# Altium schematic sheet Sheet2.SchDoc
size B
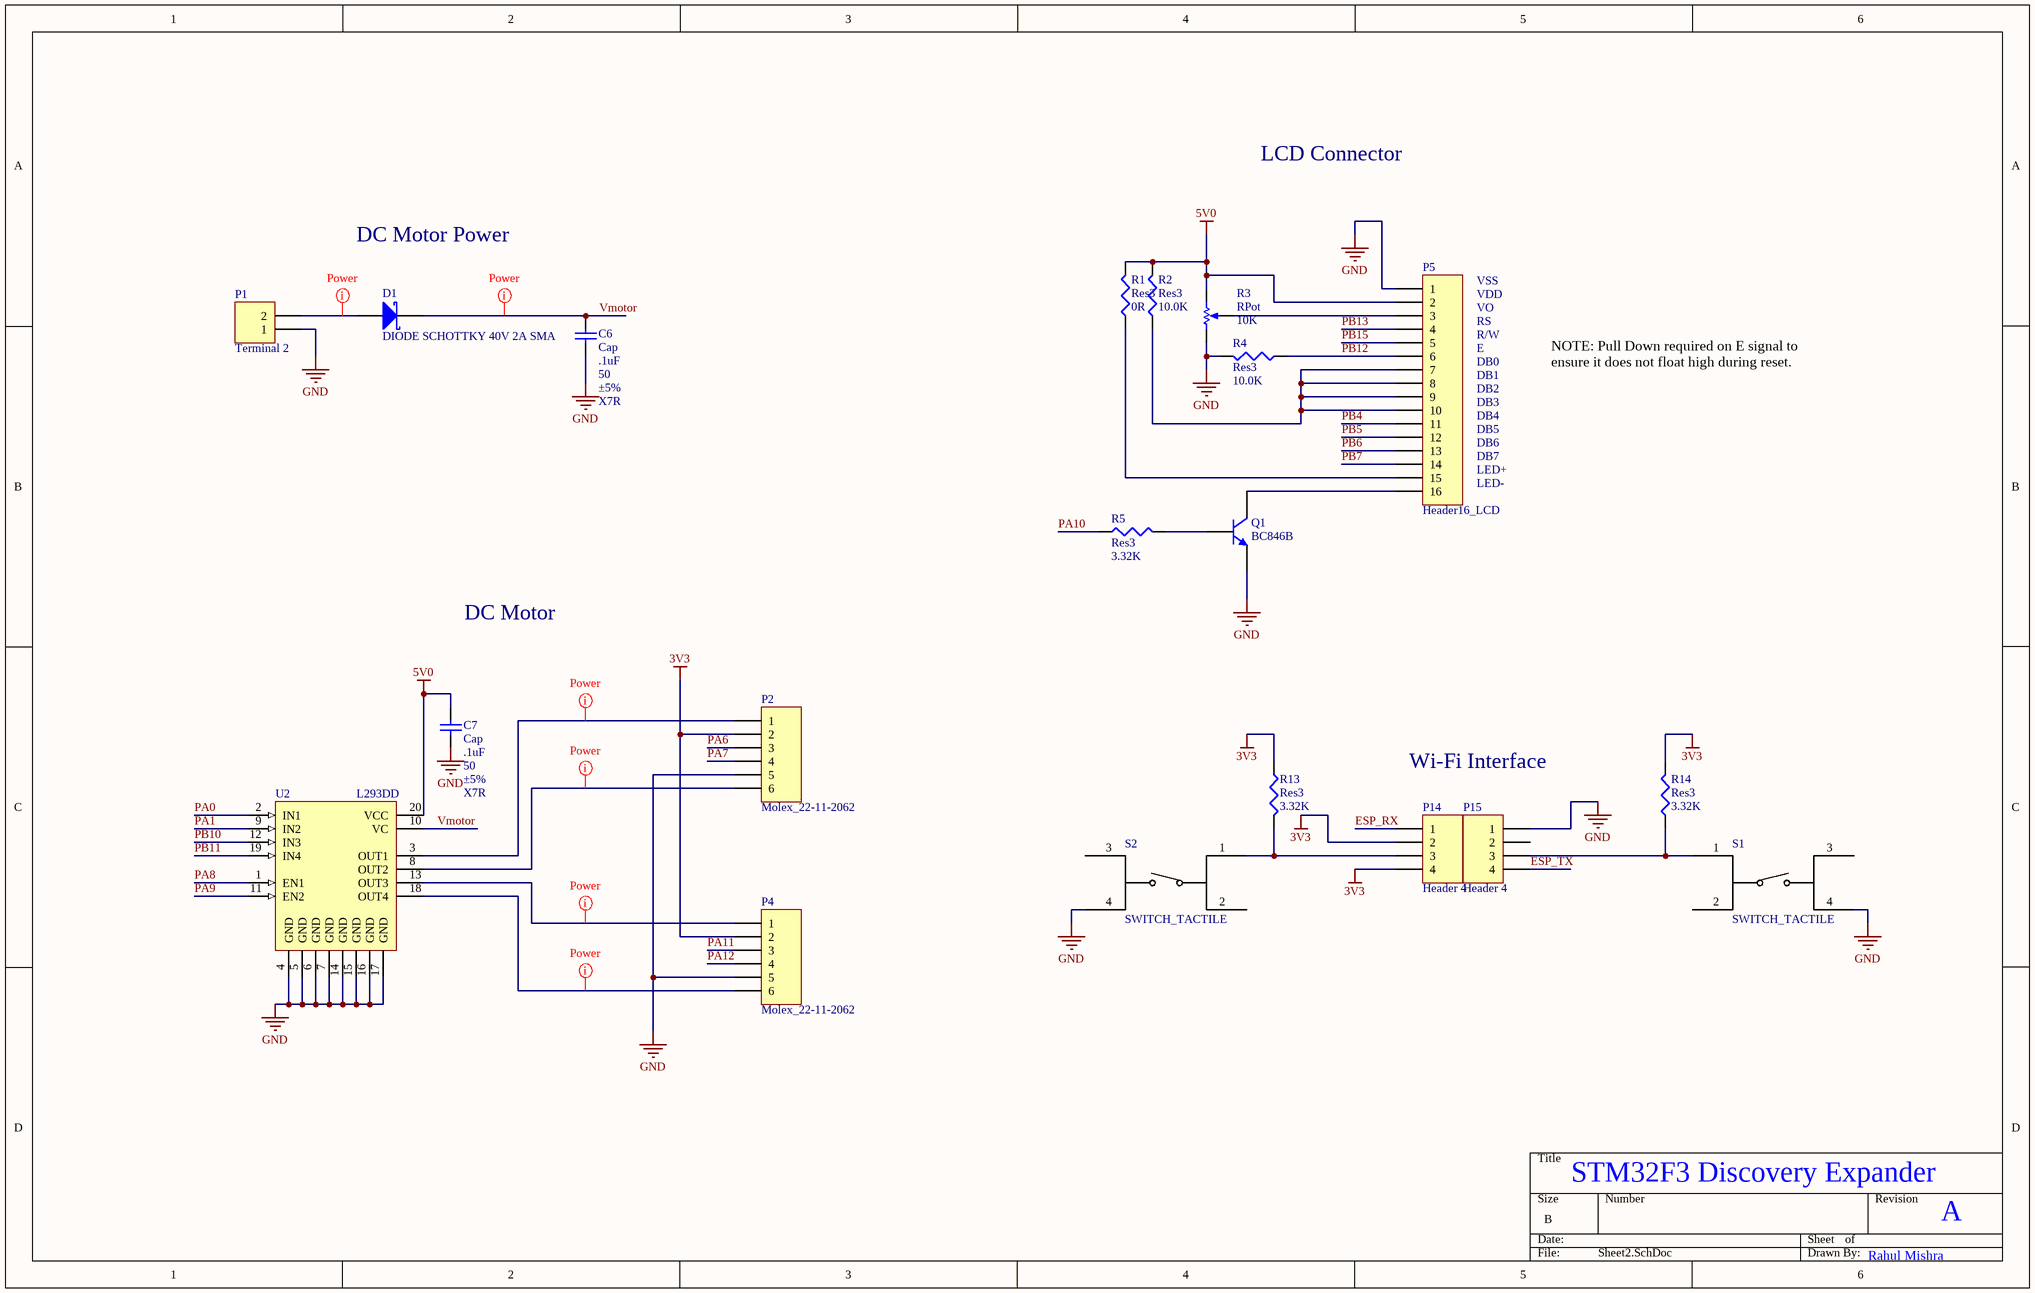
[diagram p0: Sheet2.SchDoc]

## Parts
C6  Cap  value .1uF  WV: 50  Tolerance: ±5%  Type: X7R  [CAPC2012X09M]
C7  Cap  value .1uF  WV: 50  Tolerance: ±5%  Type: X7R  [CAPC2012X09M]
D1  DIODE SCHOTTKY 40V 2A SMA  [DIOM4326X23M]
P1  Terminal 2  [TYCO_282841_2]
P2  Molex_22-11-2062  [MOLEX_22-11-2062]
P4  Molex_22-11-2062  [MOLEX_22-11-2062]
P5  Header16_LCD  [HDR1X16_LCD]
P14  Header 4  [HDR1X4]
P15  Header 4  [HDR1X4]
Q1  BC846B  [SOT95P230X110-3M]
R1  Res3  value 0R  [RESC2112X05M]
R2  Res3  value 10.0K  [RESC2112X05M]
R3  RPot  value 10K  [BOURNS_3386F]
R4  Res3  value 10.0K  [RESC2112X05M]
R5  Res3  value 3.32K  [RESC2112X05M]
R13  Res3  value 3.32K  [RESC2112X05M]
R14  Res3  value 3.32K  [RESC2112X05M]
S1  SWITCH_TACTILE  [TACT_SWITCH_6MM_SMT]
S2  SWITCH_TACTILE  [TACT_SWITCH_6MM_SMT]
U2  L293DD  [SO20_N]

## Nets
3V3: P2.2 P4.2 P14.2 P14.4 R13.2 R14.2
5V0: C7.2 P5.2 R1.2 R2.2 R3.3(BOT) U2.20(VCC)
GND: C6.1 C7.1 P1.1 P2.5 P4.5 P5.1 P15.1 Q1.2(E) R3.1(TOP) R4.2 S1.4 S2.4 U2.4(GND) U2.5(GND) U2.6(GND) U2.7(GND) U2.14(GND) U2.15(GND) U2.16(GND) U2.17(GND)
ESP_RX: P14.1
ESP_TX: P15.4
PA0: U2.2(IN1)
PA1: U2.9(IN2)
PA6: P2.3
PA7: P2.4
PA8: U2.1(EN1)
PA9: U2.11(EN2)
PA10: R5.1
PA11: P4.3
PA12: P4.4
PB4: P5.11
PB5: P5.12
PB6: P5.13
PB7: P5.14
PB10: U2.12(IN3)
PB11: U2.19(IN4)
PB12: P5.6 R4.1
PB13: P5.4
PB15: P5.5
Vmotor: C6.2 D1.1(K) U2.10(VC)
NetD1_2: D1.2(A) P1.2
NetP2_1: P2.1 U2.3(OUT1)
NetP2_6: P2.6 U2.8(OUT2)
NetP4_1: P4.1 U2.13(OUT3)
NetP4_6: P4.6 U2.18(OUT4)
NetP5_3: P5.3 R3.2(TAP)
NetP5_7: P5.7 P5.8 P5.9 P5.10 R2.1
NetP5_15: P5.15 R1.1
NetP5_16: P5.16 Q1.3(C)
NetP14_3: P14.3 R13.1 S2.1
NetP15_3: P15.3 R14.1 S1.1
NetQ1_1: Q1.1(B) R5.2

Not connected (* = marked no-connect by the designer): P15 2; S1 2 3; S2 2 3

## Layout directives
net class Power: NetD1_2, NetP2_1, NetP2_6, NetP4_1, NetP4_6, Vmotor

## Notes on the sheet
- LCD Connector
- DC Motor Power
- VSS
- VDD
- VO
- RS
- R/W
- E
- DB0
- DB1
- DB2
- DB3
- DB4
- DB5
- NOTE: Pull Down required on E signal to ensure it does not float high during reset.
- DB6
- DB7
- LED+
- LED-
- DC Motor
- Wi-Fi Interface
- STM32F3 Discovery Expander
- A
- Rahul Mishra

## Library data of the parts
C6 C7 = CAP-X7R-.1uF-50V-±5%: CAP CER .1uF 50v X7R 0805; MPN: C0805C104J5RACTU; PN: 399-1171-1-ND; Name: CAP-X7R-.1uF-50V-±5%; URL: http://www.digikey.ca/product-detail/en/C0805C104J5RACTU/399-1171-1-ND
D1 = DIODE SCHOTTKY 40V 2A SMA: Schottky Rectifier; MPN: B240A-13-F; PN: B240A-FDICT-ND; URL: http://www.digikey.ca/product-detail/en/B240A-13-F/B240A-FDICT-ND
P1 = Terminal 2: Terminal, 2-Pin; MPN: 282841-2; PN: A98342-ND; LatestRevisionDate: 17-Jul-2002; LatestRevisionNote: Re-released for DXP Platform.; Publisher: Altium Limited; URL: http://www.digikey.ca/product-detail/en/282841-2/A98342-ND/1136740
P2 P4 = Molex_22-11-2062: CONN HEADER 6POS .100 VERT GOLD; MPN: 0022112062; PN: WM2704-ND; URL: http://www.digikey.ca/product-detail/en/0022112062/WM2704-ND
P5 = Header16_LCD: Header, 16-Pin Female; MPN: PPPC161LFBN-RC; PN: S7049-ND; URL: http://www.digikey.ca/product-detail/en/PPPC161LFBN-RC/S7049-ND
P14 P15 = Header 4: Header, 4-Pin Male; MPN: PEC04SFAN; PN: S1212E-04-ND; URL: http://www.digikey.ca/product-detail/en/PEC04SFAN/S1212E-04-ND
Q1 = BC846B: TRANS NPN 65V 0.1A SOT23; MPN: BC846BLT3G; PN: BC846BLT3GOSCT-ND; URL: https://www.digikey.ca/product-detail/en/on-semiconductor/BC846BLT3G/BC846BLT3GOSCT-ND
R1 = Resistor_0R_Jumper: RES SMD 0 OHM 5% 1/8W 0805; MPN: CRCW08050000Z0EA; PN: 541-0.0ACT-ND; Name: Resistor_0R_Jumper; URL: http://www.digikey.ca/product-detail/en/CRCW08050000Z0EA/541-0.0ACT-ND
R2 R4 = Resistor_10.0K: RES SMD 10.0K OHM 1% 1/8W 0805; MPN: CRCW080510K0FKEA; PN: 541-10.0KCCT-ND; Name: Resistor_10.0K; URL: http://www.digikey.ca/product-detail/en/CRCW080510K0FKEA/541-10.0KCCT-ND
R3 = RPot: POT 10K OHM THUMBWHEEL CERM ST; MPN: 3352T-1-103LF; Sim Note: Enter the Resistance value and the set point into parameter fields.; Set Position: 0.5; PN: 3352T-103LF-ND; Published: 8-Jun-2000; LatestRevisionDate: 17-Jul-2002; LatestRevisionNote: Re-released for DXP Platform.; PackageReference: VR5; Publisher: Altium Limited; PackageDescription: Variable Resistor, Thru-Hole; 3 Leads; URL: http://www.digikey.ca/product-detail/en/3352T-1-103LF/3352T-103LF-ND
R5 R13 R14 = Resistor_3.32K: RES SMD 3.32K OHM 1% 1/8W 0805; MPN: CRCW08053K32FKEA; PN: 541-3.32KCCT-ND; Name: Resistor_3.32K; URL: http://www.digikey.ca/product-detail/en/CRCW08053K32FKEA/541-3.32KCCT-ND
S1 S2 = SWITCH_TACTILE: SWITCH TACTILE SPST-NO 0.05A 12V; MPN: PTS645SH50SMTR92 LFS; PN: CKN9085CT-ND; URL: http://www.digikey.ca/product-detail/en/PTS645SH50SMTR92%20LFS/CKN9085CT-ND
U2 = L293DD: IC MOTOR DRIVER PAR 20-SOIC; MPN: L293DD013TR; PN: 497-2937-1-ND; Published: 8-Jun-2000; LatestRevisionDate: 13-Apr-2006; LatestRevisionNote: IPC-7351 Footprint Added.; DatasheetVersion: Jun-1996; PackageVersion: Jul-2001; PackageReference: SO20; Publisher: Altium Limited; PackageDescription: 20-Pin Plastic Small Outline Integrated Circuit 1.27 mm Pitch; Code_JEDEC: MS-013-AC; Code_IPC: SOIC127P1030-20; ComponentLink1Description: Manufacturer Link; ComponentLink1URL: http://www.st.com/; ComponentLink2Description: Datasheet; ComponentLink2URL: http://www.st.com/stonline/products/literature/ds/1330/l293d.pdf; URL: http://www.digikey.ca/product-detail/en/L293DD013TR/497-2937-1-ND